# Altium project praline.PrjPcb (part 1 of 3)
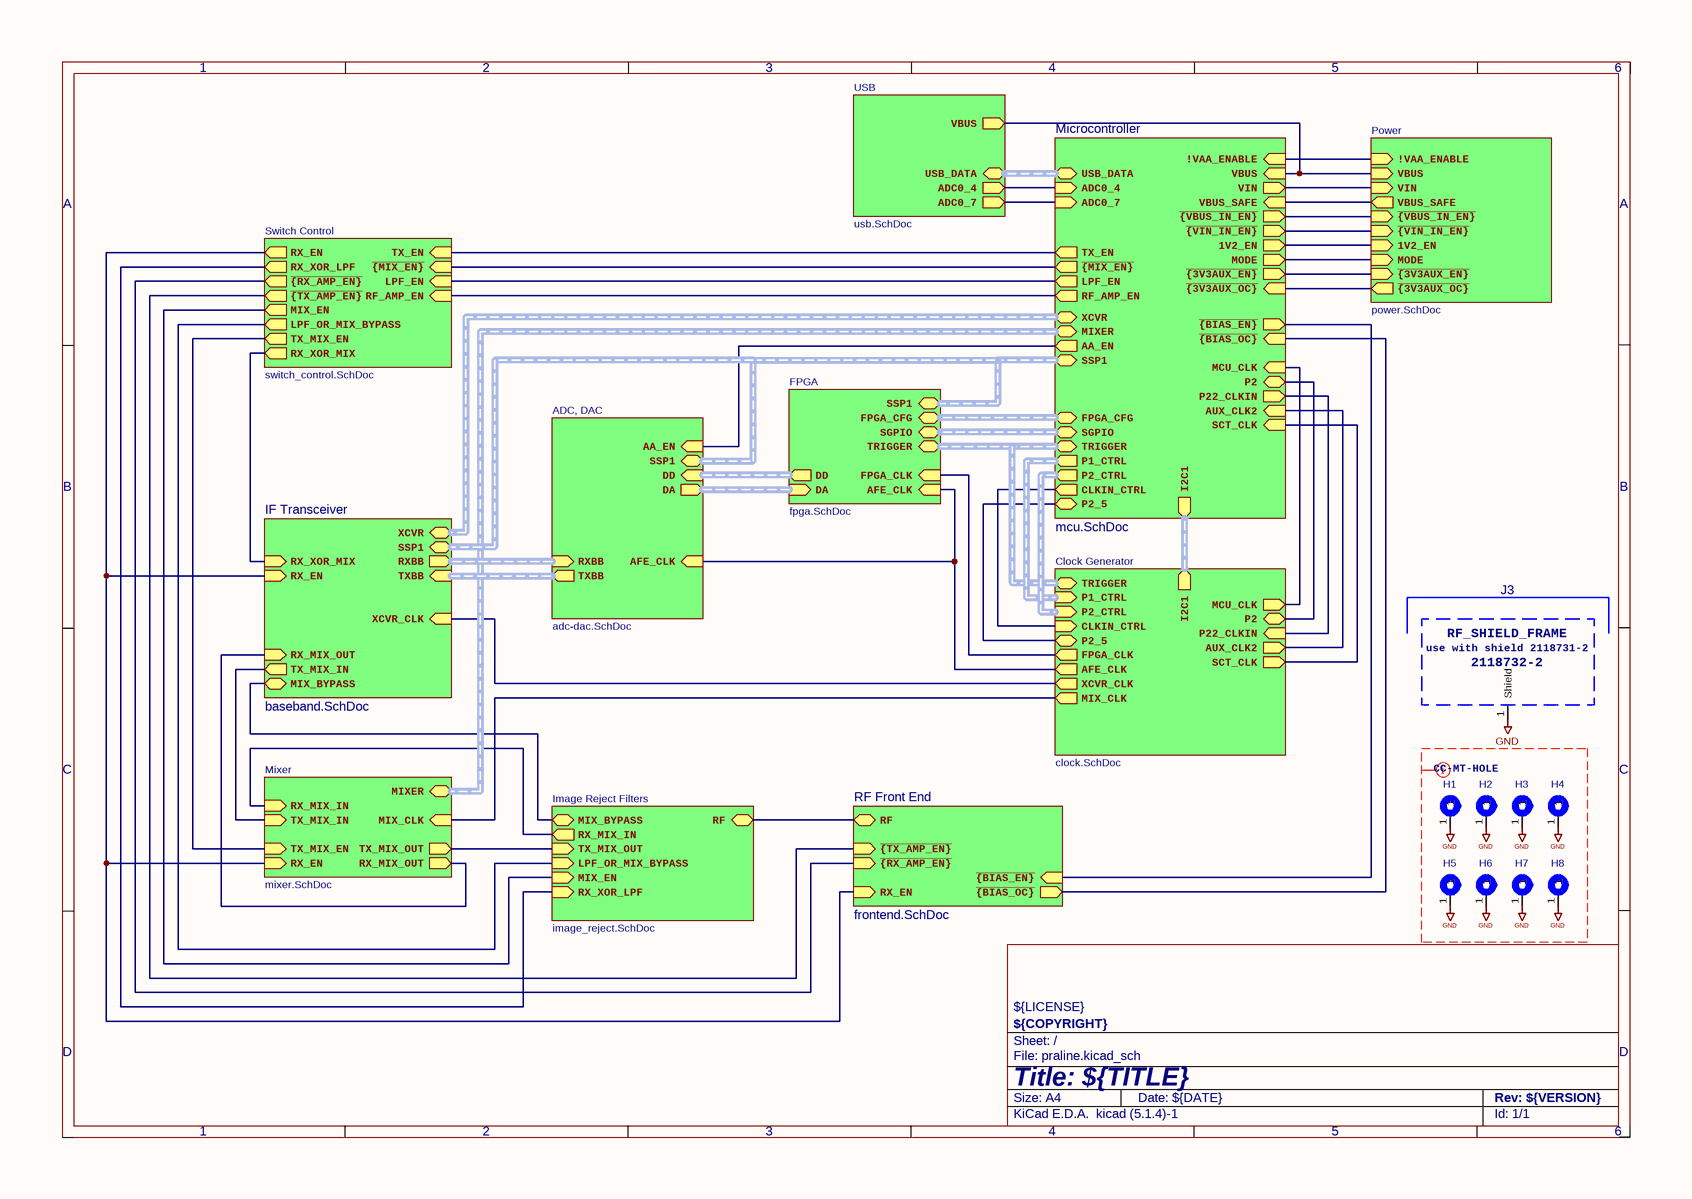
[diagram p0: praline.SchDoc]
12 sheets, 580 parts. Net scope: hierarchical (ports join the sheet entries above them; power ports are global).
Board file: praline.PcbDoc
Sheets:
  praline.SchDoc
    Microcontroller = mcu.SchDoc
    IF Transceiver = baseband.SchDoc
    RF Front End = frontend.SchDoc
    ADC, DAC = adc-dac.SchDoc
    Power = power.SchDoc
    USB = usb.SchDoc
    Mixer = mixer.SchDoc
    Clock Generator = clock.SchDoc
    Switch Control = switch_control.SchDoc
    FPGA = fpga.SchDoc
    Image Reject Filters = image_reject.SchDoc

## Sheet praline.SchDoc
size 297 x 209 mm

### Parts
H1  MountingHole_Pad  [MountingHole_3.2mm_M3_Pad_Via]  (value not drawn)
H2  MountingHole_Pad  [MountingHole_3.2mm_M3_Pad_Via]  (value not drawn)
H3  MountingHole_Pad  [MountingHole_3.2mm_M3_Pad_Via]  (value not drawn)
H4  MountingHole_Pad  [MountingHole_3.2mm_M3_Pad_Via]  (value not drawn)
H5  MountingHole_Pad  [MountingHole_2.2mm_M2_Pad_Via]  (value not drawn)
H6  MountingHole_Pad  [MountingHole_2.2mm_M2_Pad_Via]  (value not drawn)
H7  MountingHole_Pad  [MountingHole_2.2mm_M2_Pad_Via]  (value not drawn)
H8  MountingHole_Pad  [MountingHole_2.2mm_M2_Pad_Via]  (value not drawn)
J3  Part Number: 2118732-2  Note: use with shield 2118731-2  [Laird_Technologies_BMI-S-230-F_50.8x38.1mm]  (hidden comment: RF_SHIELD_FRAME)

### Sub-sheets
ADC, DAC = adc-dac.SchDoc: AFE_CLK (in), RXBB (in, harness RXBB), TXBB (out, harness TXBB), DD (in, harness DD), DA (out, harness DA), AA_EN (in), SSP1 (bidir, harness SSP1)
Clock Generator = clock.SchDoc: MCU_CLK (out), AFE_CLK (out), MIX_CLK (out), XCVR_CLK (out), TRIGGER (bidir, harness TRIGGER), SCT_CLK (out), FPGA_CLK (out), P2_5 (bidir), AUX_CLK2 (out), P1_CTRL (in, harness P1_CTRL), P22_CLKIN (in), P2_CTRL (in, harness P2_CTRL), P2 (bidir), CLKIN_CTRL (in), I2C1 (out, harness I2C1)
FPGA = fpga.SchDoc: DD (out, harness DD), DA (in, harness DA), AFE_CLK (in), FPGA_CLK (in), TRIGGER (bidir, harness TRIGGER), SGPIO (bidir, harness SGPIO), FPGA_CFG (bidir, harness FPGA_CFG), SSP1 (bidir, harness SSP1)
IF Transceiver = baseband.SchDoc: TXBB (in, harness TXBB), RXBB (out, harness RXBB), XCVR_CLK (in), RX_XOR_MIX (in), RX_EN (in), MIX_BYPASS (bidir), TX_MIX_IN (out), RX_MIX_OUT (in), SSP1 (bidir, harness SSP1), XCVR (bidir, harness XCVR)
Image Reject Filters = image_reject.SchDoc: RX_MIX_IN (out), TX_MIX_OUT (in), MIX_BYPASS (bidir), RX_XOR_LPF (in), MIX_EN (in), LPF_OR_MIX_BYPASS (in), RF (bidir)
Microcontroller = mcu.SchDoc: MCU_CLK (in), 1V2_EN (out), VIN (out), VBUS_SAFE (in), ~{{VBUS_IN_EN}} (out), ~{{VIN_IN_EN}} (out), MODE (out), LPF_EN (out), RF_AMP_EN (out), TX_EN (out), ~{{MIX_EN}} (out), ~{{BIAS_EN}} (out), ~{{BIAS_OC}} (in), ~{{3V3AUX_EN}} (out), ~{{3V3AUX_OC}} (in), VBUS (in), USB_DATA (bidir, harness USB_DATA), XCVR (bidir, harness XCVR), SCT_CLK (in), MIXER (bidir, harness MIXER), AA_EN (out), AUX_CLK2 (in), P22_CLKIN (out), P2 (bidir), ADC0_4 (in), ADC0_7 (in), P2_5 (bidir), CLKIN_CTRL (out), P2_CTRL (out, harness P2_CTRL), P1_CTRL (out, harness P1_CTRL), TRIGGER (bidir, harness TRIGGER), SGPIO (bidir, harness SGPIO), FPGA_CFG (bidir, harness FPGA_CFG), SSP1 (bidir, harness SSP1), !VAA_ENABLE (in), I2C1 (out, harness I2C1)
Mixer = mixer.SchDoc: MIX_CLK (in), RX_EN (in), RX_MIX_IN (in), TX_MIX_IN (in), RX_MIX_OUT (out), TX_MIX_OUT (out), MIXER (bidir, harness MIXER), TX_MIX_EN (in)
Power = power.SchDoc: 1V2_EN (in), ~{{VBUS_IN_EN}} (in), VBUS (in), MODE (in), ~{{VIN_IN_EN}} (in), VIN (in), VBUS_SAFE (out), ~{{3V3AUX_EN}} (in), ~{{3V3AUX_OC}} (out), !VAA_ENABLE (in)
RF Front End = frontend.SchDoc: ~{{TX_AMP_EN}} (in), ~{{BIAS_OC}} (out), ~{{RX_AMP_EN}} (in), ~{{BIAS_EN}} (in), RX_EN (in), RF (bidir)
Switch Control = switch_control.SchDoc: TX_EN (in), RX_EN (out), MIX_EN (out), RF_AMP_EN (in), LPF_EN (in), ~{{MIX_EN}} (in), RX_XOR_MIX (out), RX_XOR_LPF (out), ~{{TX_AMP_EN}} (out), ~{{RX_AMP_EN}} (out), LPF_OR_MIX_BYPASS (out), TX_MIX_EN (out)
USB = usb.SchDoc: VBUS (out), USB_DATA (bidir, harness USB_DATA), ADC0_4 (out), ADC0_7 (out)

### Nets
GND: H1.1 H2.1 H3.1 H4.1 H5.1 H6.1 H7.1 H8.1 J3.1(Shield)
1V2_EN: sheet Microcontroller/1V2_EN, sheet Power/1V2_EN
!VAA_ENABLE: sheet Microcontroller/!VAA_ENABLE, sheet Power/!VAA_ENABLE
AA_EN: sheet Microcontroller/AA_EN, sheet ADC, DAC/AA_EN
ADC0_4: sheet Microcontroller/ADC0_4, sheet USB/ADC0_4
ADC0_7: sheet Microcontroller/ADC0_7, sheet USB/ADC0_7
AFE_CLK: sheet ADC, DAC/AFE_CLK, sheet Clock Generator/AFE_CLK, sheet FPGA/AFE_CLK
AUX_CLK2: sheet Microcontroller/AUX_CLK2, sheet Clock Generator/AUX_CLK2
CLKIN_CTRL: sheet Microcontroller/CLKIN_CTRL, sheet Clock Generator/CLKIN_CTRL
FPGA_CLK: sheet Clock Generator/FPGA_CLK, sheet FPGA/FPGA_CLK
LPF_EN: sheet Microcontroller/LPF_EN, sheet Switch Control/LPF_EN
LPF_OR_MIX_BYPASS: sheet Switch Control/LPF_OR_MIX_BYPASS, sheet Image Reject Filters/LPF_OR_MIX_BYPASS
MCU_CLK: sheet Microcontroller/MCU_CLK, sheet Clock Generator/MCU_CLK
MIX_BYPASS: sheet IF Transceiver/MIX_BYPASS, sheet Image Reject Filters/MIX_BYPASS
MIX_CLK: sheet Mixer/MIX_CLK, sheet Clock Generator/MIX_CLK
MIX_EN: sheet Switch Control/MIX_EN, sheet Image Reject Filters/MIX_EN
MODE: sheet Microcontroller/MODE, sheet Power/MODE
P2: sheet Microcontroller/P2, sheet Clock Generator/P2
P2_5: sheet Microcontroller/P2_5, sheet Clock Generator/P2_5
P22_CLKIN: sheet Microcontroller/P22_CLKIN, sheet Clock Generator/P22_CLKIN
RF: sheet RF Front End/RF, sheet Image Reject Filters/RF
RF_AMP_EN: sheet Microcontroller/RF_AMP_EN, sheet Switch Control/RF_AMP_EN
RX_EN: sheet IF Transceiver/RX_EN, sheet RF Front End/RX_EN, sheet Mixer/RX_EN, sheet Switch Control/RX_EN
RX_MIX_IN: sheet Mixer/RX_MIX_IN, sheet Image Reject Filters/RX_MIX_IN
RX_MIX_OUT: sheet IF Transceiver/RX_MIX_OUT, sheet Mixer/RX_MIX_OUT
RX_XOR_LPF: sheet Switch Control/RX_XOR_LPF, sheet Image Reject Filters/RX_XOR_LPF
RX_XOR_MIX: sheet IF Transceiver/RX_XOR_MIX, sheet Switch Control/RX_XOR_MIX
SCT_CLK: sheet Microcontroller/SCT_CLK, sheet Clock Generator/SCT_CLK
TX_EN: sheet Microcontroller/TX_EN, sheet Switch Control/TX_EN
TX_MIX_EN: sheet Mixer/TX_MIX_EN, sheet Switch Control/TX_MIX_EN
TX_MIX_IN: sheet IF Transceiver/TX_MIX_IN, sheet Mixer/TX_MIX_IN
TX_MIX_OUT: sheet Mixer/TX_MIX_OUT, sheet Image Reject Filters/TX_MIX_OUT
VBUS: sheet Microcontroller/VBUS, sheet Power/VBUS, sheet USB/VBUS
VBUS_SAFE: sheet Microcontroller/VBUS_SAFE, sheet Power/VBUS_SAFE
VIN: sheet Microcontroller/VIN, sheet Power/VIN
XCVR_CLK: sheet IF Transceiver/XCVR_CLK, sheet Clock Generator/XCVR_CLK
~{{3V3AUX_EN}}: sheet Microcontroller/~{{3V3AUX_EN}}, sheet Power/~{{3V3AUX_EN}}
~{{3V3AUX_OC}}: sheet Microcontroller/~{{3V3AUX_OC}}, sheet Power/~{{3V3AUX_OC}}
~{{BIAS_EN}}: sheet Microcontroller/~{{BIAS_EN}}, sheet RF Front End/~{{BIAS_EN}}
~{{BIAS_OC}}: sheet Microcontroller/~{{BIAS_OC}}, sheet RF Front End/~{{BIAS_OC}}
~{{MIX_EN}}: sheet Microcontroller/~{{MIX_EN}}, sheet Switch Control/~{{MIX_EN}}
~{{RX_AMP_EN}}: sheet RF Front End/~{{RX_AMP_EN}}, sheet Switch Control/~{{RX_AMP_EN}}
~{{TX_AMP_EN}}: sheet RF Front End/~{{TX_AMP_EN}}, sheet Switch Control/~{{TX_AMP_EN}}
~{{VBUS_IN_EN}}: sheet Microcontroller/~{{VBUS_IN_EN}}, sheet Power/~{{VBUS_IN_EN}}
~{{VIN_IN_EN}}: sheet Microcontroller/~{{VIN_IN_EN}}, sheet Power/~{{VIN_IN_EN}}

### Buses and harness runs
harness sheet ADC, DAC/DA = sheet FPGA/DA
harness sheet ADC, DAC/DD = sheet FPGA/DD
harness sheet ADC, DAC/RXBB = sheet IF Transceiver/RXBB
harness sheet ADC, DAC/SSP1 = sheet FPGA/SSP1 = sheet IF Transceiver/SSP1 = sheet Microcontroller/SSP1
harness sheet ADC, DAC/TXBB = sheet IF Transceiver/TXBB
harness sheet Clock Generator/I2C1 = sheet Microcontroller/I2C1
harness sheet Clock Generator/P1_CTRL = sheet Microcontroller/P1_CTRL
harness sheet Clock Generator/P2_CTRL = sheet Microcontroller/P2_CTRL
harness sheet Clock Generator/TRIGGER = sheet FPGA/TRIGGER = sheet Microcontroller/TRIGGER
harness sheet FPGA/FPGA_CFG = sheet Microcontroller/FPGA_CFG
harness sheet FPGA/SGPIO = sheet Microcontroller/SGPIO
harness sheet IF Transceiver/XCVR = sheet Microcontroller/XCVR
harness sheet Microcontroller/MIXER = sheet Mixer/MIXER
harness sheet Microcontroller/USB_DATA = sheet USB/USB_DATA

### Layout directives
CompClassName: CC-MT-HOLE: GND

### Notes on the sheet
- 1
- 2
- 3
- 4
- 5
- 6
- A
- B
- C
- ${LICENSE}
- D
- Title: ${TITLE}
- File: praline.kicad_sch
- Sheet: /
- ${COPYRIGHT}
- KiCad E.D.A.  kicad (5.1.4)-1
- Size: A4
- Date: ${DATE}
- Rev: ${VERSION}
- Id: 1/1

### Library data of the parts
J3 = RFShield_TwoPieces: Manufacturer: TE Connectivity; Value: RF_SHIELD_FRAME; Footprint: praline:Laird_Technologies_BMI-S-230-F_50.8x38.1mm
H1-H8 = MountingHole_Pad: Value: MountingHole_Pad
  H1-H4: Footprint: praline:MountingHole_3.2mm_M3_Pad_Via
  H5-H8: Footprint: MountingHole:MountingHole_2.2mm_M2_Pad_Via

## Sheet mcu.SchDoc
size 431 x 279 mm
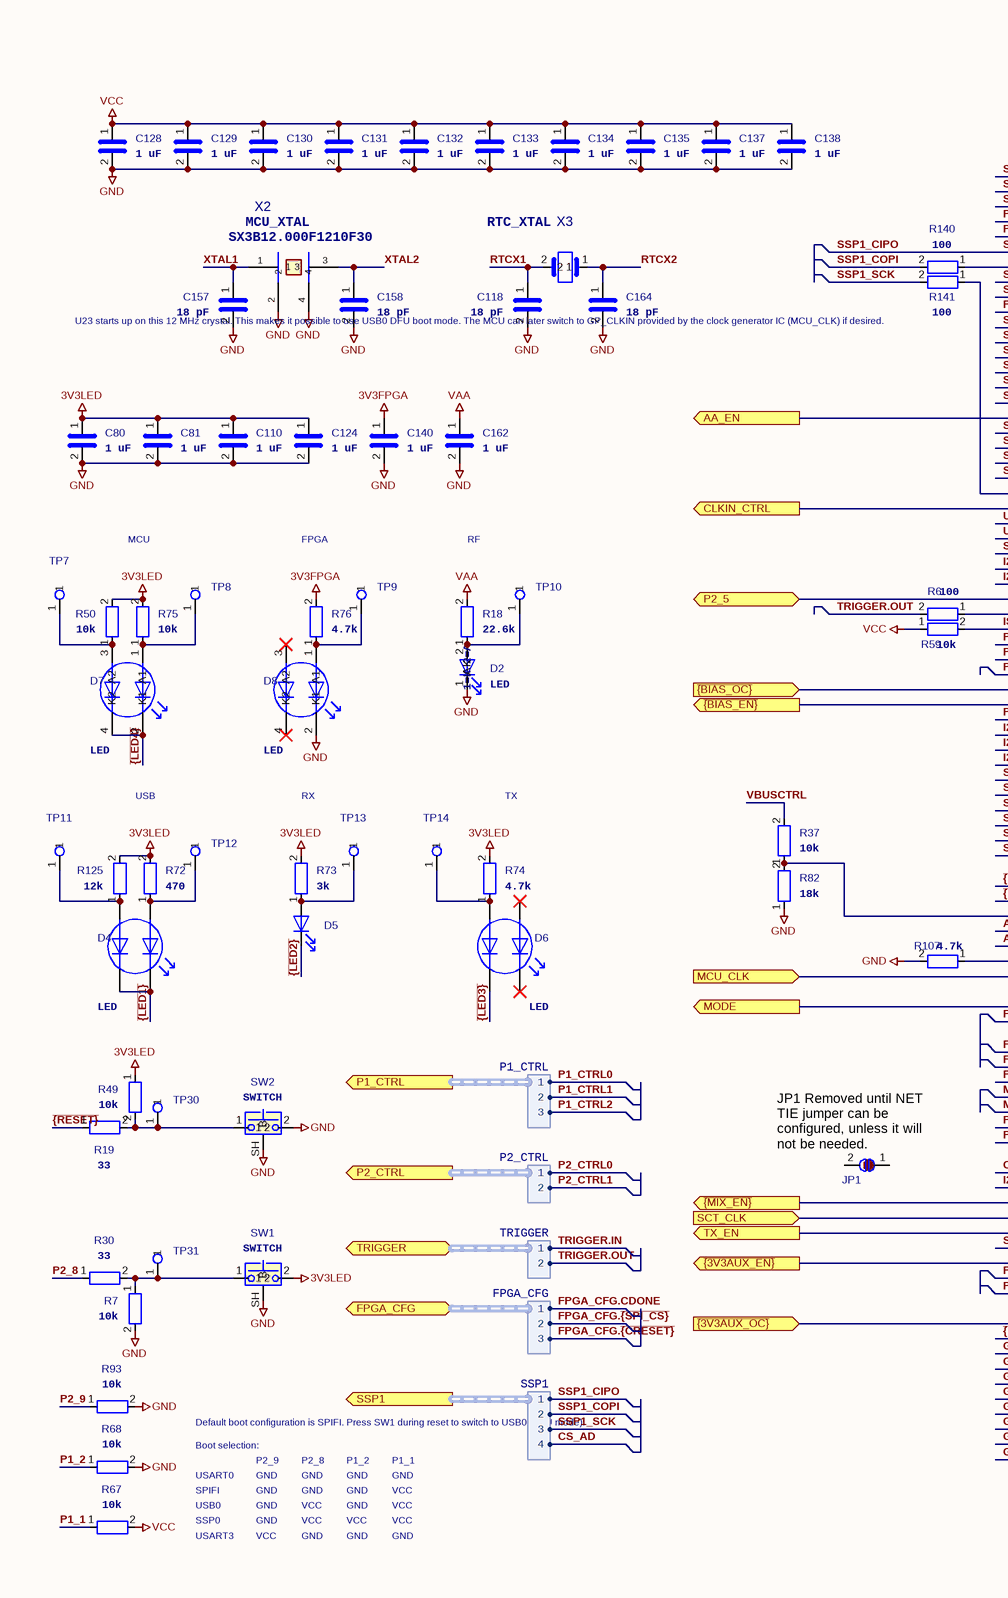
[diagram p1: mcu.SchDoc, left]
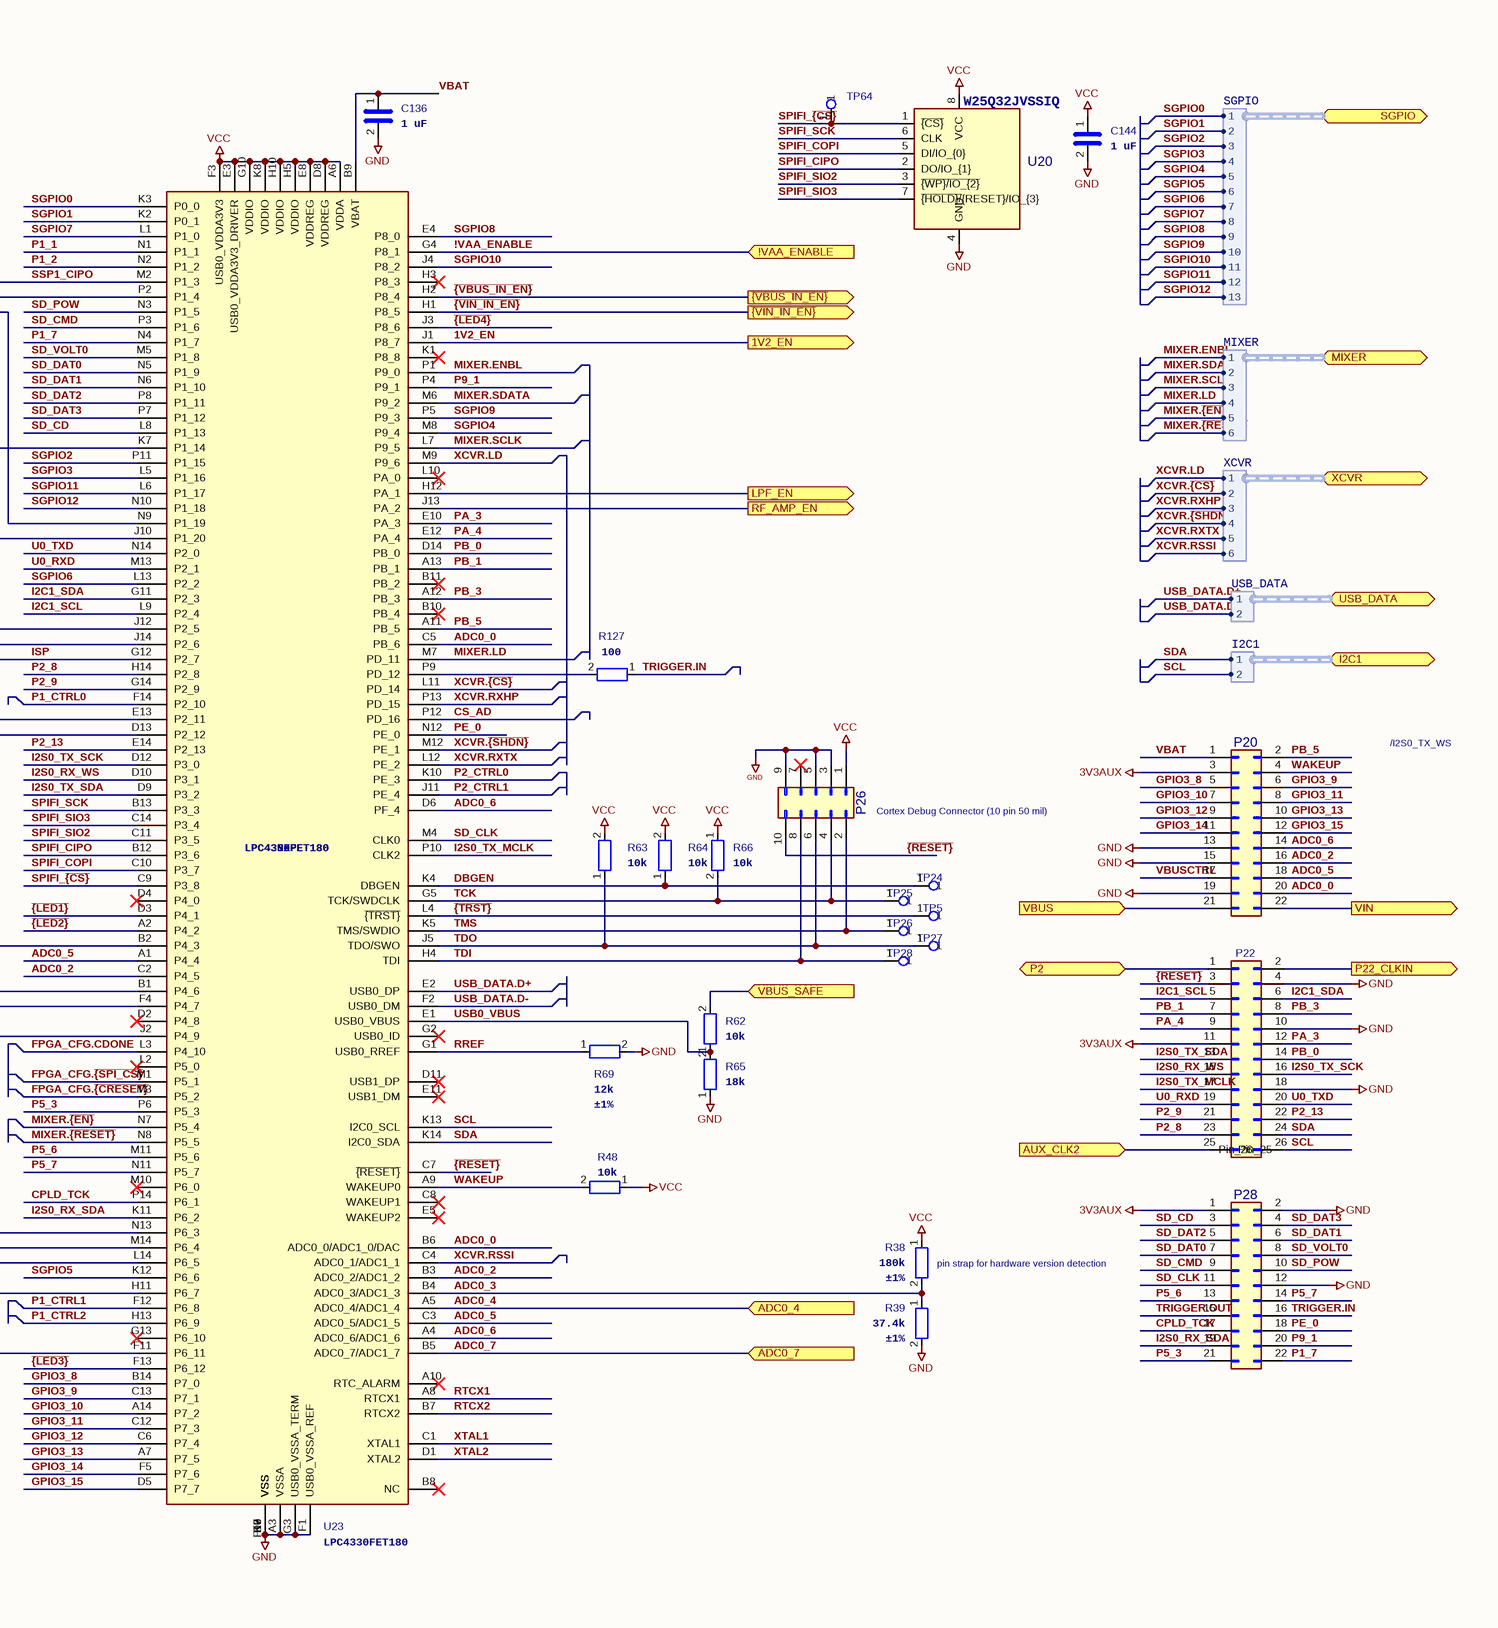
[diagram p2: mcu.SchDoc, right]

### Parts
C80  1 uF  [C_0402_1005Metric]
C81  1 uF  [C_0402_1005Metric]
C110  1 uF  [C_0402_1005Metric]
C118  18 pF  [C_0402_1005Metric]
C124  1 uF  [C_0402_1005Metric]
C128  1 uF  [C_0402_1005Metric]
C129  1 uF  [C_0402_1005Metric]
C130  1 uF  [C_0402_1005Metric]
C131  1 uF  [C_0402_1005Metric]
C132  1 uF  [C_0402_1005Metric]
C133  1 uF  [C_0402_1005Metric]
C134  1 uF  [C_0402_1005Metric]
C135  1 uF  [C_0402_1005Metric]
C136  1 uF  [C_0402_1005Metric]
C137  1 uF  [C_0402_1005Metric]
C138  1 uF  [C_0402_1005Metric]
C140  1 uF  [C_0402_1005Metric]
C144  1 uF  [C_0402_1005Metric]
C157  18 pF  [C_0402_1005Metric]
C158  18 pF  [C_0402_1005Metric]
C162  1 uF  [C_0402_1005Metric]
C164  18 pF  [C_0402_1005Metric]
D2  Sim.Pins: 1=K 2=A  [LED_Single_Xinglight_XL-3210_Horizontal]  (hidden comment: LED)
D4  LED  [LED_Dual_Xinglight_XL-3210_Horizontal]
D5  LED  [LED_Single_Xinglight_XL-3210_Horizontal]  (value not drawn)
D6  LED  [LED_Dual_Xinglight_XL-3210_Horizontal]
D7  LED  [LED_Dual_Xinglight_XL-3210_Horizontal]
D8  LED  [LED_Dual_Xinglight_XL-3210_Horizontal]
JP1  SolderJumper_2_Bridged  [SolderJumper-2_P1.3mm_Bridged_RoundedPad1.0x1.5mm]  (value not drawn)  (graphical)
P20  HEADER_2x11  [PinSocket_2x11_P2.54mm_Vertical_Flipped]  (value not drawn)
P22  HEADER_2x13  [PinSocket_2x13_P2.54mm_Vertical_Flipped]  (value not drawn)
P26  LPC_JTAG  [PinHeader_2x05_P1.27mm_Vertical]  (value not drawn)
P28  HEADER_2x11  [PinSocket_2x11_P2.54mm_Vertical_Flipped]  (value not drawn)
R6  100  [R_0201_0603Metric]
R7  10k  [R_0402_1005Metric]
R18  22.6k  [R_0201_0603Metric]
R19  33  [R_0201_0603Metric]
R30  33  [R_0201_0603Metric]
R37  10k  [R_0402_1005Metric]
R38  Tolerance: ±1%  [R_0402_1005Metric]  (hidden comment: 180k)
R39  Tolerance: ±1%  [R_0402_1005Metric]  (hidden comment: 37.4k)
R48  10k  [R_0402_1005Metric]
R49  10k  [R_0402_1005Metric]
R50  10k  [R_0402_1005Metric]
R59  10k  [R_0402_1005Metric]
R62  10k  [R_0402_1005Metric]
R63  10k  [R_0402_1005Metric]
R64  10k  [R_0402_1005Metric]
R65  18k  [R_0402_1005Metric]
R66  10k  [R_0402_1005Metric]
R67  10k  [R_0402_1005Metric]
R68  10k  [R_0402_1005Metric]
R69  Tolerance: ±1%  [R_0201_0603Metric]  (hidden comment: 12k)
R72  470  [R_0201_0603Metric]
R73  3k  [R_0402_1005Metric]
R74  4.7k  [R_0201_0603Metric]
R75  10k  [R_0402_1005Metric]
R76  4.7k  [R_0201_0603Metric]
R82  18k  [R_0402_1005Metric]
R93  10k  [R_0402_1005Metric]
R107  4.7k  [R_0201_0603Metric]
R125  12k  [R_0201_0603Metric]
R127  100  [R_0201_0603Metric]
R140  100  [R_0201_0603Metric]
R141  100  [R_0201_0603Metric]
SW1  SWITCH  [SW_Tactile_SPST_Angled_PTS645Vx58-2LFS]
SW2  SWITCH  [SW_Tactile_SPST_Angled_PTS645Vx58-2LFS]
TP5  TestPoint  [TestPoint_Pad_D1.0mm]  (value not drawn)
TP7  TestPoint  [TestPoint_Pad_D1.0mm]  (value not drawn)
TP8  TestPoint  [TestPoint_Pad_D1.0mm]  (value not drawn)
TP9  TestPoint  [TestPoint_Pad_D1.0mm]  (value not drawn)
TP10  TestPoint  [TestPoint_Pad_D1.0mm]  (value not drawn)
TP11  TestPoint  [TestPoint_Pad_D1.0mm]  (value not drawn)
TP12  TestPoint  [TestPoint_Pad_D1.0mm]  (value not drawn)
TP13  TestPoint  [TestPoint_Pad_D1.0mm]  (value not drawn)
TP14  TestPoint  [TestPoint_Pad_D1.0mm]  (value not drawn)
TP24  TestPoint  [TestPoint_Pad_D1.0mm]  (value not drawn)
TP25  TestPoint  [TestPoint_Pad_D1.0mm]  (value not drawn)
TP26  TestPoint  [TestPoint_Pad_D1.0mm]  (value not drawn)
TP27  TestPoint  [TestPoint_Pad_D1.0mm]  (value not drawn)
TP28  TestPoint  [TestPoint_Pad_D1.0mm]  (value not drawn)
TP30  TestPoint  [TestPoint_Pad_D1.0mm]  (value not drawn)
TP31  TestPoint  [TestPoint_Pad_D1.0mm]  (value not drawn)
TP64  TestPoint  [TestPoint_Pad_D1.0mm]  (value not drawn)
U20  Part Number: W25Q32JVSSIQ  [SOIC-8_5.3x5.3mm_P1.27mm]  (hidden comment: W25Q32)
U23  Manufacturer: NXP  Substitution: LPC4350FET180  [TFBGA-180_12x12mm_Layout14x14_P0.8mm]  (hidden comment: LPC4330FET180)
X2  Part Number: SX3B12.000F1210F30  [Crystal_SMD_3225-4Pin_3.2x2.5mm]  (hidden comment: MCU_XTAL)
X3  RTC_XTAL  [Crystal_SMD_3215-2Pin_3.2x1.5mm]

### Ports
1V2_EN (out), !VAA_ENABLE (in), AA_EN (out), ADC0_4 (in), ADC0_7 (in), AUX_CLK2 (in), CLKIN_CTRL (out), FPGA_CFG (bidir, harness FPGA_CFG), I2C1 (bidir, harness I2C1), LPF_EN (out), MCU_CLK (in), MIXER (bidir, harness MIXER), MODE (out), P1_CTRL (out, harness P1_CTRL), P2 (bidir), P2_5 (bidir), P2_CTRL (out, harness P2_CTRL), P22_CLKIN (out), RF_AMP_EN (out), SCT_CLK (in), SGPIO (bidir, harness SGPIO), SSP1 (out, harness SSP1), TRIGGER (bidir, harness TRIGGER), TX_EN (out), USB_DATA (bidir, harness USB_DATA), VBUS (in), VBUS_SAFE (in), VIN (out), XCVR (bidir, harness XCVR), ~{{3V3AUX_EN}} (out), ~{{3V3AUX_OC}} (in), ~{{BIAS_EN}} (out), ~{{BIAS_OC}} (in), ~{{MIX_EN}} (out), ~{{VBUS_IN_EN}} (out), ~{{VIN_IN_EN}} (out)

### Harnesses
XCVR: 1, 5, 4, 3, 2, 6
MIXER: 1, 6, 5, 4, 3, 2
USB_DATA: 1, 2
SGPIO: 1, 5, 4, 3, 2, 13, 7, 8, 11, 9, 12, 10, 6
P1_CTRL: 1, 2, 3
P2_CTRL: 1, 2
TRIGGER: 1, 2
FPGA_CFG: 1, 2, 3
SSP1: 1, 2, 3, 4
I2C1: 1, 2

### Nets
3V3AUX: P20.3(Pin_3) P22.11(Pin_11) P28.1(Pin_1)
3V3FPGA: C140.1 R76.2
3V3LED: C80.1 C81.1 C110.1 C124.1 R49.1 R50.2 R72.2 R73.2 R74.2 R75.2 R125.2 SW1.2
GND: C80.2 C81.2 C110.2 C118.2 C124.2 C128.2 C129.2 C130.2 C131.2 C132.2 C133.2 C134.2 C135.2 C136.2 C137.2 C138.2 C140.2 C144.2 C157.2 C158.2 C162.2 C164.2 D2.1(K) D8.2(K1) P20.13(Pin_13) P20.15(Pin_15) P20.19(Pin_19) P22.4(Pin_4) P22.10(Pin_10) P22.18(Pin_18) P26.3(Pin_3) P26.5(Pin_5) P26.9(Pin_9) P28.2(Pin_2) P28.12(Pin_12) R7.2 R39.2 R65.1 R68.2 R69.2 R82.1 R93.2 R107.2 SW1.SH(B) SW2.2 SW2.SH(B) U20.4(GND) U23.A3(VSSA) U23.D7(VSS) U23.E6(VSS) U23.E7(VSS) U23.E9(VSS) U23.F1(USB0_VSSA_REF) U23.F10(VSS) U23.G3(USB0_VSSA_TERM) U23.K6(VSS) U23.K9(VSS) X2.2 X2.4
VAA: C162.1 R18.2
VCC: C128.1 C129.1 C130.1 C131.1 C132.1 C133.1 C134.1 C135.1 C137.1 C138.1 C144.1 P26.1(Pin_1) R38.1 R48.1 R59.1 R63.2 R64.2 R66.1 R67.2 U20.8(VCC) U23.A6(VDDA) U23.D8(VDDREG) U23.E3(USB0_VDDA3V3_DRIVER) U23.E8(VDDREG) U23.F3(USB0_VDDA3V3) U23.G10(VDDIO) U23.H5(VDDIO) U23.H10(VDDIO) U23.K8(VDDIO)
1V2_EN: U23.J1(P8_7) ; port 1V2_EN
!VAA_ENABLE: U23.G4(P8_1) ; port !VAA_ENABLE
AA_EN: U23.K7(P1_14) ; port AA_EN
ADC0_0: P20.20(Pin_20) U23.B6(ADC0_0/ADC1_0/DAC) U23.C5(PB_6)
ADC0_2: P20.16(Pin_16) U23.B3(ADC0_2/ADC1_2) U23.C2(P4_5)
ADC0_3: R38.2 R39.1 U23.B4(ADC0_3/ADC1_3)
ADC0_4: U23.A5(ADC0_4/ADC1_4) ; port ADC0_4
ADC0_5: P20.18(Pin_18) U23.A1(P4_4) U23.C3(ADC0_5/ADC1_5)
ADC0_6: P20.14(Pin_14) U23.A4(ADC0_6/ADC1_6) U23.D6(PF_4)
ADC0_7: U23.B5(ADC0_7/ADC1_7) ; port ADC0_7
AUX_CLK2: P22.25(Pin_25) ; port AUX_CLK2
CLKIN_CTRL: U23.J10(P1_20) ; port CLKIN_CTRL
CPLD_TCK: P28.17(Pin_17) U23.P14(P6_1)
CS_AD: U23.P12(PD_16) ; port SSP1.4
DBGEN: R64.1 TP24.1 U23.K4(DBGEN)
FPGA_CFG.CDONE: U23.L3(P4_10) ; port FPGA_CFG.1
FPGA_CFG.~{{CRESET}}: U23.M3(P5_2) ; port FPGA_CFG.3
FPGA_CFG.~{{SPI_CS}}: U23.M1(P5_1) ; port FPGA_CFG.2
GPIO3_8: P20.5(Pin_5) U23.B14(P7_0)
GPIO3_9: P20.6(Pin_6) U23.C13(P7_1)
GPIO3_10: P20.7(Pin_7) U23.A14(P7_2)
GPIO3_11: P20.8(Pin_8) U23.C12(P7_3)
GPIO3_12: P20.9(Pin_9) U23.C6(P7_4)
GPIO3_13: P20.10(Pin_10) U23.A7(P7_5)
GPIO3_14: P20.11(Pin_11) U23.F5(P7_6)
GPIO3_15: P20.12(Pin_12) U23.D5(P7_7)
I2C1_SCL: P22.5(Pin_5) U23.L9(P2_4)
I2C1_SDA: P22.6(Pin_6) U23.G11(P2_3)
I2S0_RX_SDA: P28.19(Pin_19) U23.K11(P6_2)
I2S0_RX_WS: P22.15(Pin_15) U23.D10(P3_1)
I2S0_TX_MCLK: P22.17(Pin_17) U23.P10(CLK2)
I2S0_TX_SCK: P22.16(Pin_16) U23.D12(P3_0)
I2S0_TX_SDA: P22.13(Pin_13) U23.D9(P3_2)
ISP: R59.2 U23.G12(P2_7)
LPF_EN: U23.H12(PA_1) ; port LPF_EN
MCU_CLK: U23.F4(P4_7) ; port MCU_CLK
MIXER.ENBL: U23.P1(P9_0) ; port MIXER.1
MIXER.LD: U23.M7(PD_11) ; port MIXER.4
MIXER.SCLK: U23.L7(P9_5) ; port MIXER.3
MIXER.SDATA: U23.M6(P9_2) ; port MIXER.2
MIXER.~{{EN}}: U23.N7(P5_4) ; port MIXER.5
MIXER.~{{RESET}}: U23.N8(P5_5) ; port MIXER.6
MODE: U23.J2(P4_9) ; port MODE
P1_1: R67.1 U23.N1(P1_1)
P1_2: R68.1 U23.N2(P1_2)
P1_7: P28.22(Pin_22) U23.N4(P1_7)
P1_CTRL0: U23.F14(P2_10) ; port P1_CTRL.1
P1_CTRL1: U23.F12(P6_8) ; port P1_CTRL.2
P1_CTRL2: U23.H13(P6_9) ; port P1_CTRL.3
P2: P22.1(Pin_1) ; port P2
P2_5: U23.J12(P2_5) ; port P2_5
P2_8: P22.23(Pin_23) R30.1 U23.H14(P2_8)
P2_9: P22.21(Pin_21) R93.1 U23.G14(P2_9)
P2_13: P22.22(Pin_22) U23.E14(P2_13)
P2_CTRL0: U23.K10(PE_3) ; port P2_CTRL.1
P2_CTRL1: U23.J11(PE_4) ; port P2_CTRL.2
P5_3: P28.21(Pin_21) U23.P6(P5_3)
P5_6: P28.13(Pin_13) U23.M11(P5_6)
P5_7: P28.14(Pin_14) U23.N11(P5_7)
P9_1: P28.20(Pin_20) U23.P4(P9_1)
P22_CLKIN: P22.2(Pin_2) ; port P22_CLKIN
PA_3: P22.12(Pin_12) U23.E10(PA_3)
PA_4: P22.9(Pin_9) U23.E12(PA_4)
PB_0: P22.14(Pin_14) U23.D14(PB_0)
PB_1: P22.7(Pin_7) U23.A13(PB_1)
PB_3: P22.8(Pin_8) U23.A12(PB_3)
PB_5: P20.2(Pin_2) U23.A11(PB_5)
PE_0: P28.18(Pin_18) U23.N12(PE_0)
RF_AMP_EN: U23.J13(PA_2) ; port RF_AMP_EN
RREF: R69.1 U23.G1(USB0_RREF)
RTCX1: C118.1 U23.A8(RTCX1) X3.2
RTCX2: C164.1 U23.B7(RTCX2) X3.1
SCL: P22.26(Pin_26) U23.K13(I2C0_SCL) ; port I2C1.2
SCT_CLK: U23.M14(P6_4) ; port SCT_CLK
SD_CD: P28.3(Pin_3) U23.L8(P1_13)
SD_CLK: P28.11(Pin_11) U23.M4(CLK0)
SD_CMD: P28.9(Pin_9) U23.P3(P1_6)
SD_DAT0: P28.7(Pin_7) U23.N5(P1_9)
SD_DAT1: P28.6(Pin_6) U23.N6(P1_10)
SD_DAT2: P28.5(Pin_5) U23.P8(P1_11)
SD_DAT3: P28.4(Pin_4) U23.P7(P1_12)
SD_POW: P28.10(Pin_10) U23.N3(P1_5)
SD_VOLT0: P28.8(Pin_8) U23.M5(P1_8)
SDA: P22.24(Pin_24) U23.K14(I2C0_SDA) ; port I2C1.1
SGPIO0: U23.K3(P0_0) ; port SGPIO.1
SGPIO1: U23.K2(P0_1) ; port SGPIO.2
SGPIO2: U23.P11(P1_15) ; port SGPIO.3
SGPIO3: U23.L5(P1_16) ; port SGPIO.4
SGPIO4: U23.M8(P9_4) ; port SGPIO.5
SGPIO5: U23.K12(P6_6) ; port SGPIO.6
SGPIO6: U23.L13(P2_2) ; port SGPIO.7
SGPIO7: U23.L1(P1_0) ; port SGPIO.8
SGPIO8: U23.E4(P8_0) ; port SGPIO.9
SGPIO9: U23.P5(P9_3) ; port SGPIO.10
SGPIO10: U23.J4(P8_2) ; port SGPIO.11
SGPIO11: U23.L6(P1_17) ; port SGPIO.12
SGPIO12: U23.N10(P1_18) ; port SGPIO.13
SPIFI_CIPO: U20.2(DO/IO_{1}) U23.B12(P3_6)
SPIFI_COPI: U20.5(DI/IO_{0}) U23.C10(P3_7)
SPIFI_SCK: U20.6(CLK) U23.B13(P3_3)
SPIFI_SIO2: U20.3(~{{WP}/IO_{2}}) U23.C11(P3_5)
SPIFI_SIO3: U20.7(~{{HOLD}/}{RESET}/IO_{3}) U23.C14(P3_4)
SPIFI_~{{CS}}: TP64.1 U20.1(~{{CS}}) U23.C9(P3_8)
SSP1_CIPO: U23.M2(P1_3) ; port SSP1.1
SSP1_COPI: R140.2 ; port SSP1.2
SSP1_SCK: R141.2 ; port SSP1.3
TCK: P26.4(Pin_4) R66.2 TP25.1 U23.G5(TCK/SWDCLK)
TDI: P26.8(Pin_8) TP28.1 U23.H4(TDI)
TDO: P26.6(Pin_6) R63.1 TP27.1 U23.J5(TDO/SWO)
TMS: P26.2(Pin_2) TP26.1 U23.K5(TMS/SWDIO)
TRIGGER.IN: P28.16(Pin_16) R127.1 ; port TRIGGER.1
TRIGGER.OUT: P28.15(Pin_15) R6.2 ; port TRIGGER.2
TX_EN: U23.L14(P6_5) ; port TX_EN
U0_RXD: P22.19(Pin_19) U23.M13(P2_1)
U0_TXD: P22.20(Pin_20) U23.N14(P2_0)
USB0_VBUS: R62.1 R65.2 U23.E1(USB0_VBUS)
USB_DATA.D+: U23.E2(USB0_DP) ; port USB_DATA.1
USB_DATA.D-: U23.F2(USB0_DM) ; port USB_DATA.2
VBAT: C136.1 P20.1(Pin_1) U23.B9(VBAT)
VBUS: P20.21(Pin_21) ; port VBUS
VBUS_SAFE: R62.2 ; port VBUS_SAFE
VBUSCTRL: P20.17(Pin_17) R37.2
VIN: P20.22(Pin_22) ; port VIN
WAKEUP: P20.4(Pin_4) R48.2 U23.A9(WAKEUP0)
XCVR.LD: U23.M9(P9_6) ; port XCVR.1
XCVR.RSSI: U23.C4(ADC0_1/ADC1_1) ; port XCVR.6
XCVR.RXHP: U23.P13(PD_15) ; port XCVR.3
XCVR.RXTX: U23.L12(PE_2) ; port XCVR.5
XCVR.~{{CS}}: U23.L11(PD_14) ; port XCVR.2
XCVR.~{{SHDN}}: U23.M12(PE_1) ; port XCVR.4
XTAL1: C157.1 U23.C1(XTAL1) X2.1
XTAL2: C158.1 U23.D1(XTAL2) X2.3
~{{3V3AUX_EN}}: U23.H11(P6_7) ; port ~{{3V3AUX_EN}}
~{{3V3AUX_OC}}: U23.F11(P6_11) ; port ~{{3V3AUX_OC}}
~{{BIAS_EN}}: U23.D13(P2_12) ; port ~{{BIAS_EN}}
~{{BIAS_OC}}: U23.E13(P2_11) ; port ~{{BIAS_OC}}
~{{LED1}}: D4.2(K1) D4.4(K2) U23.D3(P4_1)
~{{LED2}}: D5.1(K) U23.A2(P4_2)
~{{LED3}}: D6.4(K2) U23.F13(P6_12)
~{{LED4}}: D7.2(K1) D7.4(K2) U23.J3(P8_6)
~{{MIX_EN}}: U23.N13(P6_3) ; port ~{{MIX_EN}}
~{{RESET}}: P22.3(Pin_3) P26.10(Pin_10) R19.1 U23.C7(~{{RESET}})
~{{TRST}}: TP5.1 U23.L4(~{{TRST}})
~{{VBUS_IN_EN}}: U23.H2(P8_4) ; port ~{{VBUS_IN_EN}}
~{{VIN_IN_EN}}: U23.H1(P8_5) ; port ~{{VIN_IN_EN}}
NetD2_2: D2.2(A) R18.1 TP10.1
NetD4_1: D4.1(A1) R72.1 TP12.1
NetD4_3: D4.3(A2) R125.1 TP11.1
NetD5_2: D5.2(A) R73.1 TP13.1
NetD6_3: D6.3(A2) R74.1 TP14.1
NetD7_1: D7.1(A1) R75.1 TP8.1
NetD7_3: D7.3(A2) R50.1 TP7.1
NetD8_1: D8.1(A1) R76.1 TP9.1
NetR6_1: R6.1 U23.J14(P2_6)
NetR7_1: R7.1 R30.2 SW1.1 TP31.1
NetR19_2: R19.2 R49.2 SW2.1 TP30.1
NetR37_1: R37.1 R82.2 U23.B2(P4_3)
NetR107_1: R107.1 U23.B1(P4_6)
NetR127_2: R127.2 U23.P9(PD_12)
NetR140_1: R140.1 U23.P2(P1_4)
NetR141_1: R141.1 U23.N9(P1_19)

Not connected (* = marked no-connect by the designer): D6 1(A1)* 2(K1)*; D8 3(A2)* 4(K2)*; JP1 1(A) 2(B); P26 7(Pin_7)*; U23 A10(RTC_ALARM)* B8(NC)* B10(PB_4)* B11(PB_2)* C8(WAKEUP1)* D2(P4_8)* D4(P4_0)* D11(USB1_DP)* E5(WAKEUP2)* E11(USB1_DM)* G2(USB0_ID)* G13(P6_10)* H3(P8_3)* K1(P8_8)* L2(P5_0)* L10(PA_0)* M10(P6_0)*

### Notes on the sheet
- U23 starts up on this 12 MHz
  crystal. This makes it possible
  to use USB0 DFU boot mode.
  The MCU can later switch
  to GP_CLKIN provided by the
  clock generator IC (MCU_CLK)
  if desired.
- MCU
- FPGA
- RF
- /I2S0_TX_WS
- USB
- RX
- TX
- (near P26) Cortex Debug
  Connector
  (10 pin 50 mil)
- (near JP1) JP1 Removed until NET TIE jumper can be configured, unless it will not be needed.
- (near R38) pin strap for hardware
  version detection
- Default boot configuration is SPIFI.
  Press SW1 during reset to switch to
  USB0 (DFU mode).
- USB0
- Boot selection:
- USART0
- SPIFI
- GND
- P2_9
- P2_8
- VCC
- P1_2
- P1_1
- SSP0
- USART3
- 1
- 2
- 3
- 4
- 5
- 6
- 7
- 8
- A
- B
- C
- D
- E
- ${LICENSE}
- Title: ${TITLE}
- File: mcu.kicad_sch
- Sheet: /
- ${COPYRIGHT}
- KiCad E.D.A.  kicad (5.1.4)-1
- Size: User
- Date: ${DATE}
- Rev: ${VERSION}
- Id: 1/1

### Library data of the parts
C80 C81 C110 C124 C128-C138 C140 C144 C162 = C: Manufacturer: Samsung; Part Number: CL05A105KA5NQNC; Substitution: Murata GRM155R61E105KA12D; Value: 1 uF; Footprint: Capacitor_SMD:C_0402_1005Metric
C118 C157 C158 C164 = C: Manufacturer: Samsung; Part Number: CL05C180JB5NNNC; Substitution: Murata GRM1555C1H180JA01D; Value: 18 pF; Footprint: Capacitor_SMD:C_0402_1005Metric
D2 = LED: Manufacturer: Xinglight; Part Number: XL-3210UGC; Value: LED; Footprint: praline:LED_Single_Xinglight_XL-3210_Horizontal
D4 = LED_Dual_AKAK: Manufacturer: Xinglight; Part Number: XL-3210SURSYGC; Value: LED; Footprint: praline:LED_Dual_Xinglight_XL-3210_Horizontal
D5 = LED: Manufacturer: Xinglight; Part Number: XL-3210UOC; Sim.Pins: 1=K 2=A; Value: LED; Footprint: praline:LED_Single_Xinglight_XL-3210_Horizontal
D6-D8 = LED_Dual_AKAK: Manufacturer: Xinglight; Part Number: XL-3210SURUBC; Value: LED; Footprint: praline:LED_Dual_Xinglight_XL-3210_Horizontal
P20 P28 = Conn_02x11_Odd_Even: Manufacturer: Sullins; Part Number: PPPC112LFBN-RC; Value: HEADER_2x11; Footprint: praline:PinSocket_2x11_P2.54mm_Vertical_Flipped
P22 = Conn_02x13_Odd_Even: Manufacturer: Sullins; Part Number: PPPC132LFBN-RC; Value: HEADER_2x13; Footprint: praline:PinSocket_2x13_P2.54mm_Vertical_Flipped
P26 = Conn_02x05_Odd_Even: Manufacturer: Sullins; Part Number: GRPB052VWVN-RC; Value: LPC_JTAG; Footprint: Connector_PinHeader_1.27mm:PinHeader_2x05_P1.27mm_Vertical
R6 R127 R140 R141 = R: Manufacturer: Yageo; Part Number: RC0201JR-07100RL; Substitution: any equivalent; Value: 100; Footprint: Resistor_SMD:R_0201_0603Metric
R7 R37 R48-R50 R59 R62-R64 R66-R68 R75 R93 = R: Manufacturer: Yageo; Part Number: RC0402JR-0710KL; Substitution: any equivalent; Value: 10k; Footprint: Resistor_SMD:R_0402_1005Metric
R18 = R: Manufacturer: Yageo; Part Number: RC0201FR-0722K6L; Substitution: any equivalent; Value: 22.6k; Footprint: Resistor_SMD:R_0201_0603Metric
R19 R30 = R: Manufacturer: Yageo; Part Number: RC0201JR-0733RL; Substitution: any equivalent; Value: 33; Footprint: Resistor_SMD:R_0201_0603Metric
R38 = R: Manufacturer: Yageo; Part Number: RC0402FR-07180KL; Substitution: any equivalent; Value: 180k; Footprint: Resistor_SMD:R_0402_1005Metric
R39 = R: Manufacturer: Yageo; Part Number: RC0402FR-0737K4L; Substitution: any equivalent; Value: 37.4k; Footprint: Resistor_SMD:R_0402_1005Metric
R65 R82 = R: Manufacturer: Yageo; Part Number: RC0402JR-0718KL; Substitution: any equivalent; Value: 18k; Footprint: Resistor_SMD:R_0402_1005Metric
R69 R125 = R: Manufacturer: Yageo; Part Number: RC0201FR-0712KL; Substitution: any equivalent; Value: 12k; Footprint: Resistor_SMD:R_0201_0603Metric
R72 = R: Manufacturer: Yageo; Part Number: RC0201JR-07470RL; Substitution: any equivalent; Value: 470; Footprint: Resistor_SMD:R_0201_0603Metric
R73 = R: Manufacturer: Yageo; Part Number: RC0402JR-073KL; Substitution: any equivalent; Value: 3k; Footprint: Resistor_SMD:R_0402_1005Metric
R74 R76 R107 = R: Manufacturer: Yageo; Part Number: RC0201FR-074K7L; Substitution: any equivalent; Value: 4.7k; Footprint: Resistor_SMD:R_0201_0603Metric
SW1 SW2 = SW_Push_Shielded: Manufacturer: TE Connectivity; Part Number: FSMRA3JH; Value: SWITCH; Footprint: praline:SW_Tactile_SPST_Angled_PTS645Vx58-2LFS
U20 = W25Q32JVSS: Manufacturer: Winbond; Value: W25Q32; Footprint: Package_SO:SOIC-8_5.3x5.3mm_P1.27mm
U23 = LPC43xxFET180: Part Number: LPC4330FET180; Value: LPC4330FET180; Footprint: praline:TFBGA-180_12x12mm_Layout14x14_P0.8mm
X2 = GSG-XTAL4PIN: Manufacturer: Shenzhen SCTF Electronics; Value: MCU_XTAL; Footprint: praline:Crystal_SMD_3225-4Pin_3.2x2.5mm
X3 = Crystal: Manufacturer: YXC; Part Number: XKXGI-SUA-32.768K; Value: RTC_XTAL; Footprint: praline:Crystal_SMD_3215-2Pin_3.2x1.5mm
JP1 = SolderJumper_2_Bridged: Value: SolderJumper_2_Bridged; Footprint: Jumper:SolderJumper-2_P1.3mm_Bridged_RoundedPad1.0x1.5mm
TP5 TP7-TP14 TP24-TP28 TP30 TP31 TP64 = TestPoint: Value: TestPoint; Footprint: TestPoint:TestPoint_Pad_D1.0mm

## Sheet baseband.SchDoc
size 297 x 209 mm
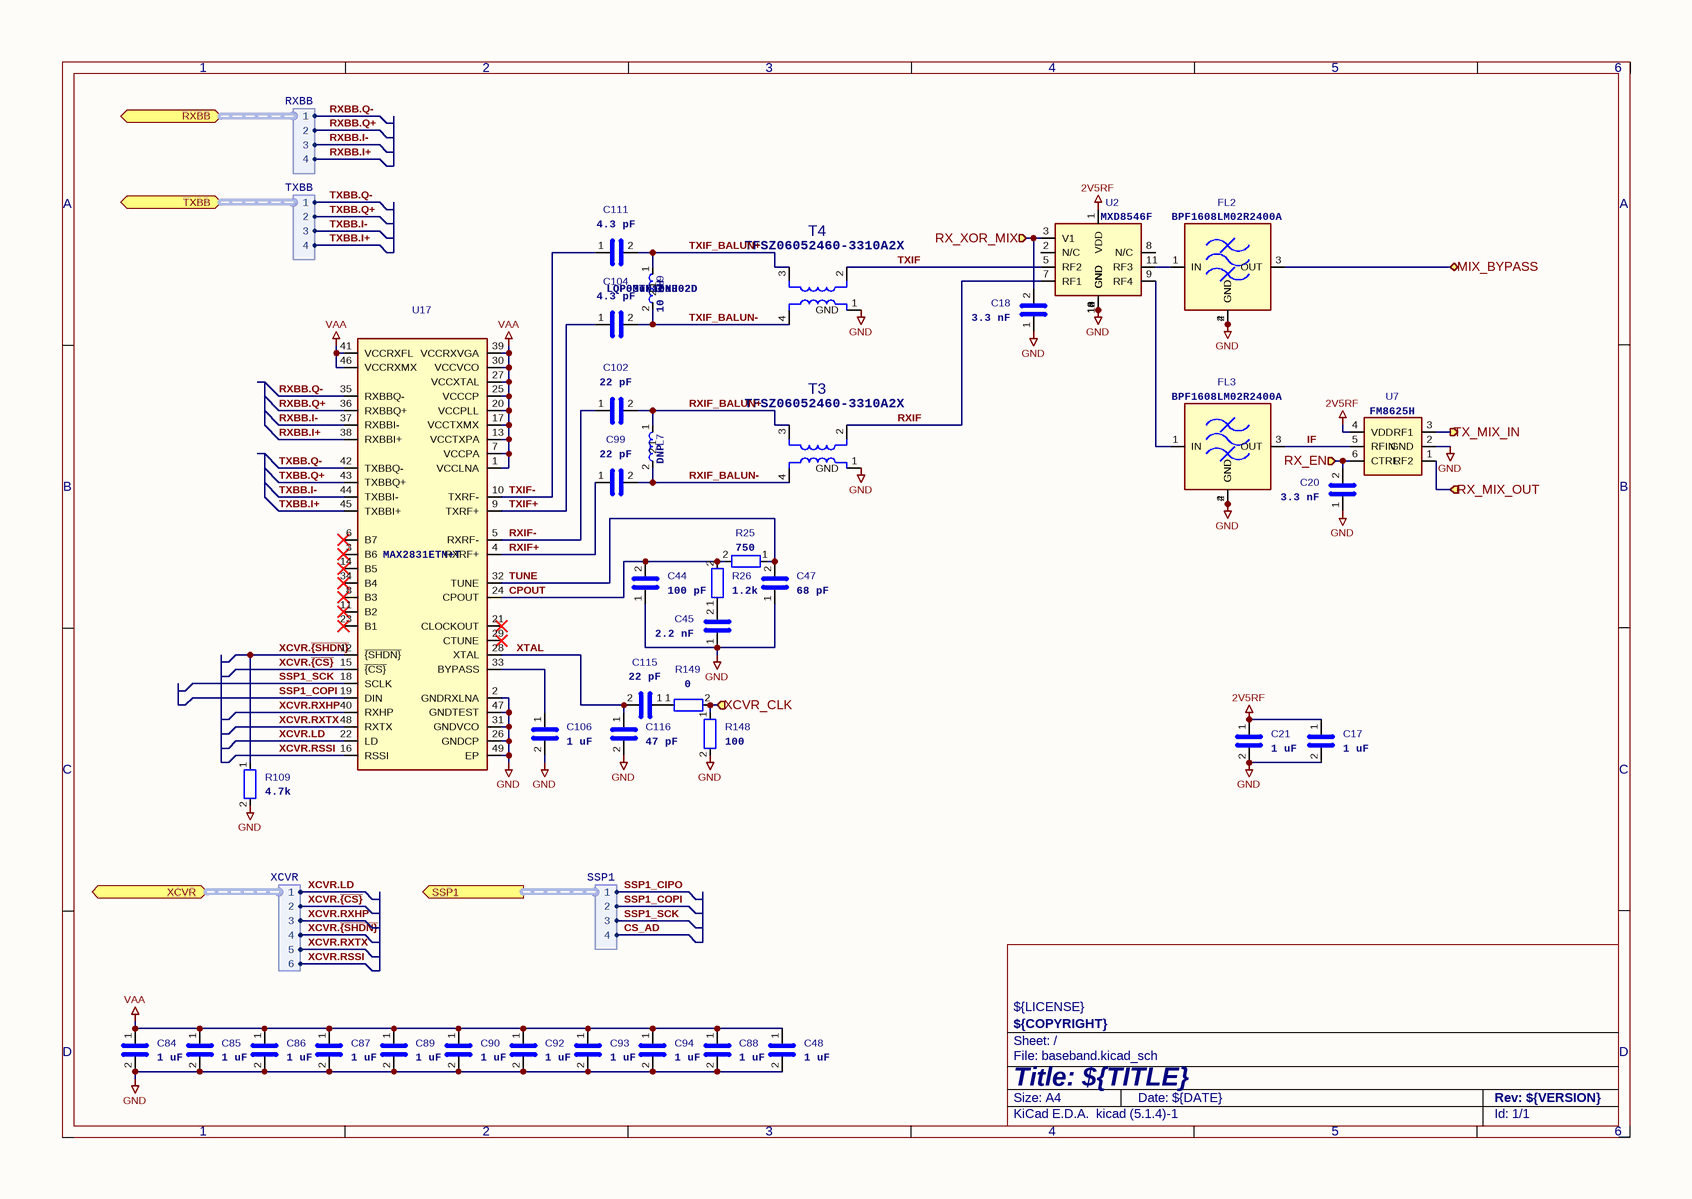
[diagram p3: baseband.SchDoc]

### Parts
C17  1 uF  [C_0201_0603Metric]
C18  3.3 nF  [C_0201_0603Metric]
C20  3.3 nF  [C_0201_0603Metric]
C21  1 uF  [C_0201_0603Metric]
C44  100 pF  [C_0201_0603Metric]
C45  2.2 nF  [C_0201_0603Metric]
C47  68 pF  [C_0201_0603Metric]
C48  1 uF  [C_0201_0603Metric]
C84  1 uF  [C_0201_0603Metric]
C85  1 uF  [C_0201_0603Metric]
C86  1 uF  [C_0201_0603Metric]
C87  1 uF  [C_0201_0603Metric]
C88  1 uF  [C_0201_0603Metric]
C89  1 uF  [C_0201_0603Metric]
C90  1 uF  [C_0201_0603Metric]
C92  1 uF  [C_0201_0603Metric]
C93  1 uF  [C_0201_0603Metric]
C94  1 uF  [C_0201_0603Metric]
C99  22 pF  [C_0201_0603Metric]
C102  22 pF  [C_0201_0603Metric]
C104  4.3 pF  [C_0201_0603Metric]
C106  1 uF  [C_0201_0603Metric]
C111  4.3 pF  [C_0201_0603Metric]
C115  22 pF  [C_0201_0603Metric]
C116  47 pF  [C_0201_0603Metric]
FL2  Part Number: BPF1608LM02R2400A  [Filter_Pulse_BPF1608LM09R5000A]  (hidden comment: BPF)
FL3  Part Number: BPF1608LM02R2400A  [Filter_Pulse_BPF1608LM09R5000A]  (hidden comment: BPF)
L7  DNP  [L_0201_0603Metric]
L9  Manufacturer: Murata  Part Number: LQP03TN10NJ02D  Substitution: LQP03TN10NH02D  [L_0201_0603Metric]  (hidden comment: 10 nH)
R25  750  [R_0201_0603Metric]
R26  1.2k  [R_0201_0603Metric]
R109  4.7k  [R_0201_0603Metric]
R148  100  [R_0201_0603Metric]
R149  0  [R_0201_0603Metric]
T3  IF_BALUN  [Balun_TDK_TFSZ06052460-3310A2X]  (value not drawn)
T4  IF_BALUN  [Balun_TDK_TFSZ06052460-3310A2X]  (value not drawn)
U2  MXD8546F  [QFN-12-1EP_2x2mm_P0.5mm_EP1x1mm]
U7  FM8625H  [TSLP-6-4_1.1x0.7mm_P0.4mm]
U17  Part Number: MAX2831ETM+T  [QFN-48-1EP_7x7mm_P0.5mm_EP5.6x5.6mm_ThermalVias]  (hidden comment: MAX2831)

### Ports
MIX_BYPASS (bidir), RX_EN (in), RX_MIX_OUT (in), RX_XOR_MIX (in), RXBB (bidir, harness RXBB), SSP1 (out, harness SSP1), TX_MIX_IN (out), TXBB (bidir, harness TXBB), XCVR (bidir, harness XCVR), XCVR_CLK (in)

### Harnesses
XCVR: 1, 5, 4, 3, 2, 6
TXBB: 1, 4, 3, 2
RXBB: 1, 4, 3, 2
SSP1: 1, 2, 3, 4

### Nets
2V5RF: C17.1 C21.1 U2.1(VDD) U7.4(VDD)
GND: C17.2 C18.1 C20.1 C21.2 C44.1 C45.1 C47.1 C48.2 C84.2 C85.2 C86.2 C87.2 C88.2 C89.2 C90.2 C92.2 C93.2 C94.2 C106.2 C116.2 FL2.2(GND) FL2.4(GND) FL3.2(GND) FL3.4(GND) R109.2 R148.2 T3.1(GND) T4.1(GND) U2.4(GND) U2.6(GND) U2.10(GND) U2.12(GND) U2.13(GND) U7.2(GND) U17.2(GNDRXLNA) U17.26(GNDCP) U17.31(GNDVCO) U17.47(GNDTEST) U17.49(EP)
VAA: C48.1 C84.1 C85.1 C86.1 C87.1 C88.1 C89.1 C90.1 C92.1 C93.1 C94.1 U17.1(VCCLNA) U17.7(VCCPA) U17.13(VCCTXPA) U17.17(VCCTXMX) U17.20(VCCPLL) U17.25(VCCCP) U17.27(VCCXTAL) U17.30(VCCVCO) U17.39(VCCRXVGA) U17.41(VCCRXFL) U17.46(VCCRXMX)
CPOUT: C44.2 R25.2 R26.2 U17.24(CPOUT)
IF: FL3.3(OUT) U7.5(RFIN)
MIX_BYPASS: FL2.3(OUT) ; port MIX_BYPASS
RX_EN: C20.2 U7.6(CTRL) ; port RX_EN
RX_MIX_OUT: U7.1(RF2) ; port RX_MIX_OUT
RX_XOR_MIX: C18.2 U2.3(V1) ; port RX_XOR_MIX
RXBB.I+: U17.38(RXBBI+) ; port RXBB.4
RXBB.I-: U17.37(RXBBI-) ; port RXBB.3
RXBB.Q+: U17.36(RXBBQ+) ; port RXBB.2
RXBB.Q-: U17.35(RXBBQ-) ; port RXBB.1
RXIF: T3.2 U2.7(RF1)
RXIF+: C99.1 U17.4(RXRF+)
RXIF-: C102.1 U17.5(RXRF-)
RXIF_BALUN+: C102.2 L7.1 T3.3
RXIF_BALUN-: C99.2 L7.2 T3.4
SSP1_COPI: U17.19(DIN) ; port SSP1.2
SSP1_SCK: U17.18(SCLK) ; port SSP1.3
TUNE: C47.2 R25.1 U17.32(TUNE)
TX_MIX_IN: U7.3(RF1) ; port TX_MIX_IN
TXBB.I+: U17.45(TXBBI+) ; port TXBB.4
TXBB.I-: U17.44(TXBBI-) ; port TXBB.3
TXBB.Q+: U17.43(TXBBQ+) ; port TXBB.2
TXBB.Q-: U17.42(TXBBQ-) ; port TXBB.1
TXIF: T4.2 U2.5(RF2)
TXIF+: C104.1 U17.9(TXRF+)
TXIF-: C111.1 U17.10(TXRF-)
TXIF_BALUN+: C111.2 L9.1 T4.3
TXIF_BALUN-: C104.2 L9.2 T4.4
XCVR.LD: U17.22(LD) ; port XCVR.1
XCVR.RSSI: U17.16(RSSI) ; port XCVR.6
XCVR.RXHP: U17.40(RXHP) ; port XCVR.3
XCVR.RXTX: U17.48(RXTX) ; port XCVR.5
XCVR.~{{CS}}: U17.15(~{{CS}}) ; port XCVR.2
XCVR.~{{SHDN}}: R109.1 U17.12(~{{SHDN}}) ; port XCVR.4
XCVR_CLK: R148.1 R149.2 ; port XCVR_CLK
XTAL: C115.2 C116.1 U17.28(XTAL)
NetC45_2: C45.2 R26.1
NetC106_1: C106.1 U17.33(BYPASS)
NetC115_1: C115.1 R149.1
NetFL2_1: FL2.1(IN) U2.11(RF3)
NetFL3_1: FL3.1(IN) U2.9(RF4)

Not connected (* = marked no-connect by the designer): U2 2(N/C) 8(N/C); U17 3(B6)* 6(B7)* 8(B3)* 11(B2)* 14(B5)* 21(CLOCKOUT)* 23(B1)* 29(CTUNE)* 34(B4)*

### Notes on the sheet
- 1
- 2
- 3
- 4
- 5
- 6
- A
- B
- C
- ${LICENSE}
- D
- Title: ${TITLE}
- File: baseband.kicad_sch
- Sheet: /
- ${COPYRIGHT}
- KiCad E.D.A.  kicad (5.1.4)-1
- Size: A4
- Date: ${DATE}
- Rev: ${VERSION}
- Id: 1/1

### Library data of the parts
C17 C21 C48 C84-C90 C92-C94 C106 = C: Manufacturer: Murata; Part Number: GRM033R61A105ME44D; Substitution: GRM033R61A105ME44*, GRM033R61C105ME15*, Samsung CL03A105MO3NRN*; Value: 1 uF; Footprint: Capacitor_SMD:C_0201_0603Metric
C18 C20 = C: Manufacturer: Murata; Part Number: GRM033R71A332KA01D; Substitution: GRM033R71A332K*; Value: 3.3 nF; Footprint: Capacitor_SMD:C_0201_0603Metric
C44 = C: Manufacturer: Murata; Part Number: GRM0335C1E101JA01D; Substitution: GRM0335C1E101JA01*, GRM0335C1H101JA01*; Value: 100 pF; Footprint: Capacitor_SMD:C_0201_0603Metric
C45 = C: Manufacturer: Murata; Part Number: GRM033R71A222KA01D; Substitution: GRM033R71A222KA01*; Value: 2.2 nF; Footprint: Capacitor_SMD:C_0201_0603Metric
C47 = C: Manufacturer: Murata; Part Number: GRM0335C1H680JA01D; Substitution: GRM0335C1H680JA01*; Value: 68 pF; Footprint: Capacitor_SMD:C_0201_0603Metric
C99 C102 C115 = C: Manufacturer: Murata; Part Number: GRM0335C1H220JA01D; Substitution: GRM0335C1H220*; Value: 22 pF; Footprint: Capacitor_SMD:C_0201_0603Metric
C104 C111 = C: Manufacturer: Murata; Part Number: GRM0335C1E4R3CA01D; Substitution: GRM0335C1E4R3*, GRM0335C1H4R3*; Value: 4.3 pF; Footprint: Capacitor_SMD:C_0201_0603Metric
C116 = C: Manufacturer: Murata; Part Number: GRM0335C1E470JA01D; Substitution: GRM0335C1E470JA01*, GRM0335C1H470JA01*; Value: 47 pF; Footprint: Capacitor_SMD:C_0201_0603Metric
FL2 FL3 = BFCN-1445: Manufacturer: Pulse Electronics; Value: BPF; Footprint: praline:Filter_Pulse_BPF1608LM09R5000A
L7 L9 = L: Footprint: Inductor_SMD:L_0201_0603Metric
  L7: Value: DNP
  L9: Value: 10 nH
R25 = R: Manufacturer: Yageo; Part Number: RC0201JR-07750RL; Substitution: any equivalent; Value: 750; Footprint: Resistor_SMD:R_0201_0603Metric
R26 = R: Manufacturer: Yageo; Part Number: RC0201JR-071K2L; Substitution: any equivalent; Value: 1.2k; Footprint: Resistor_SMD:R_0201_0603Metric
R109 = R: as R74 on sheet mcu; Value: 4.7k; Footprint: Resistor_SMD:R_0201_0603Metric
R148 = R: as R6 on sheet mcu; Value: 100; Footprint: Resistor_SMD:R_0201_0603Metric
R149 = R: Manufacturer: Yageo; Part Number: RC0201JR-070RL; Substitution: any equivalent; Value: 0; Footprint: Resistor_SMD:R_0201_0603Metric
T3 T4 = TFSZ06052460-3310A2X: Manufacturer: TDK; Part Number: TFSZ06052460-3310A2X; Value: IF_BALUN; Footprint: praline:Balun_TDK_TFSZ06052460-3310A2X
U2 = MXD8546F: Manufacturer: Maxscend; Part Number: MXD8546F; Value: MXD8546F; Footprint: praline:QFN-12-1EP_2x2mm_P0.5mm_EP1x1mm
U7 = BGS12P2L6: Manufacturer: Shenzhen Fuman; Part Number: FM8625H; Value: FM8625H; Footprint: praline:TSLP-6-4_1.1x0.7mm_P0.4mm
U17 = MAX2831: Manufacturer: Maxim; Substitution: MAX2831ETM+; Value: MAX2831; Footprint: praline:QFN-48-1EP_7x7mm_P0.5mm_EP5.6x5.6mm_ThermalVias

## Sheet frontend.SchDoc
size 297 x 209 mm
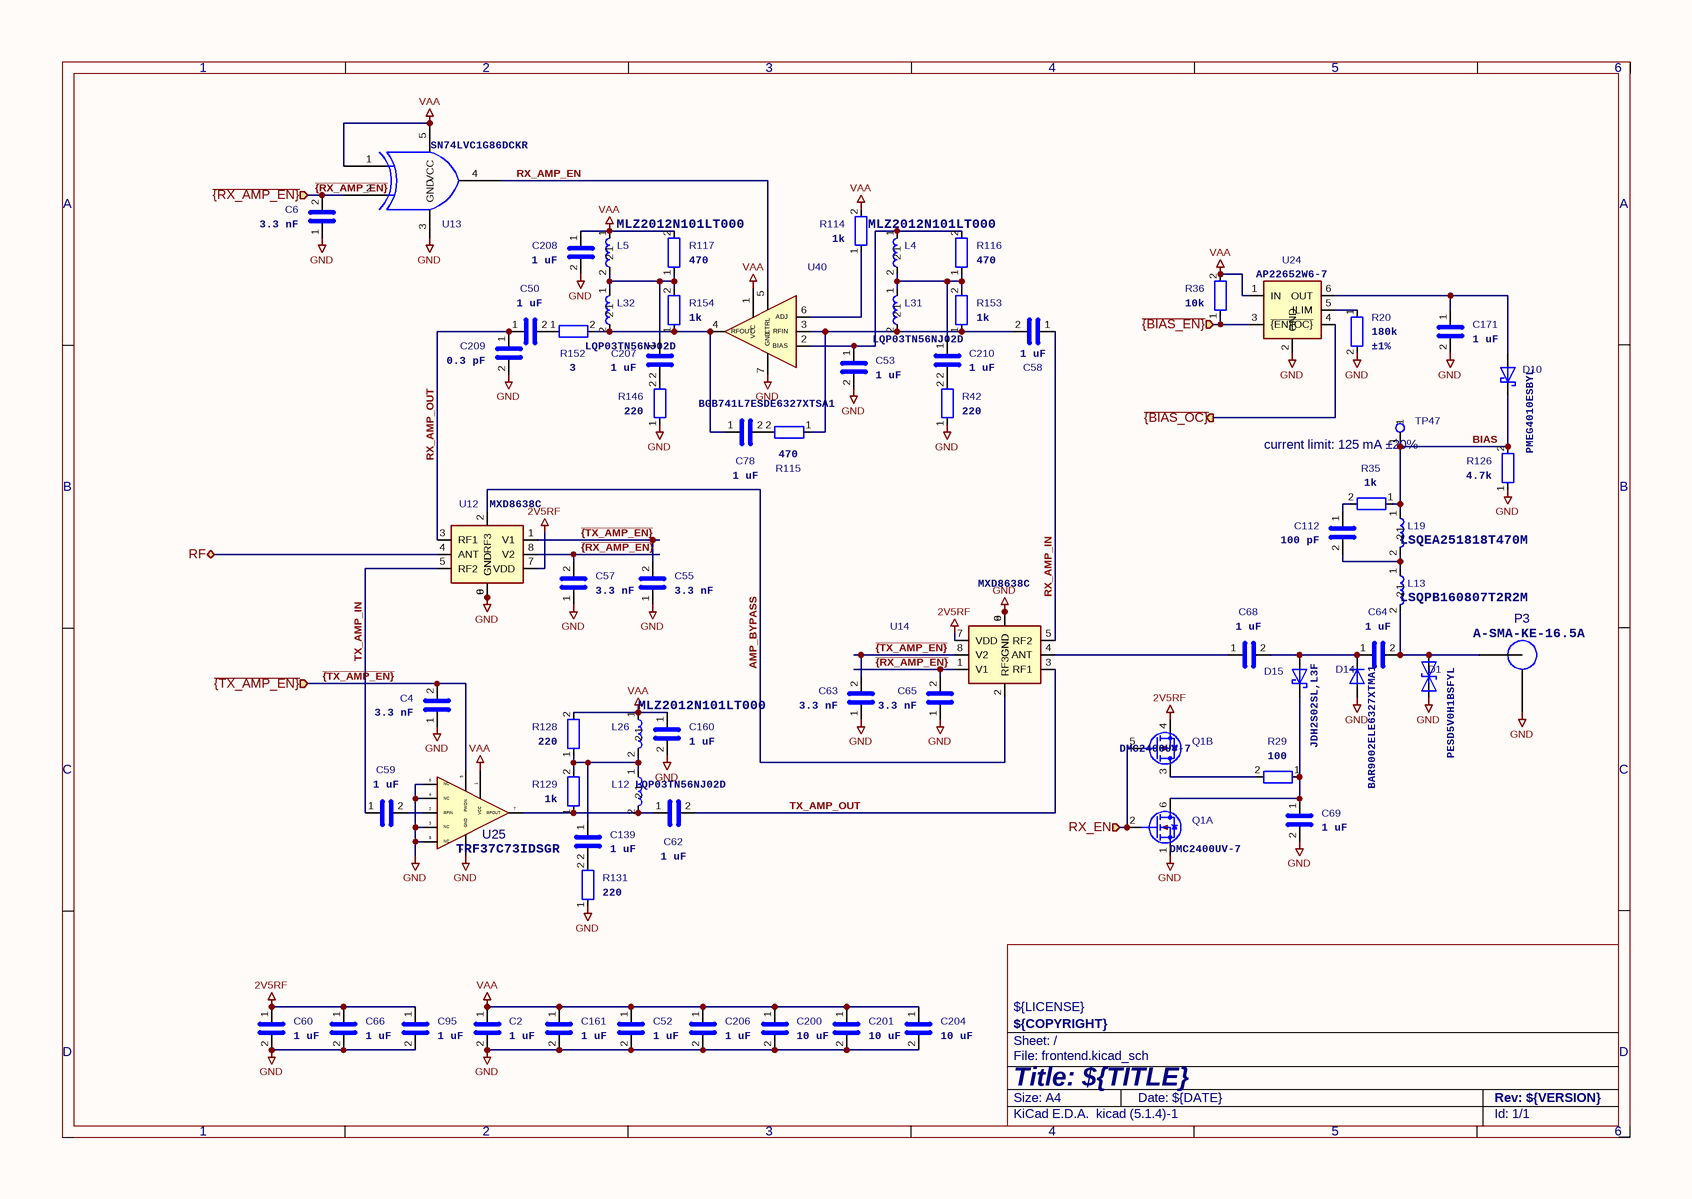
[diagram p4: frontend.SchDoc]

### Parts
C2  1 uF  [C_0201_0603Metric]
C4  3.3 nF  [C_0201_0603Metric]
C6  3.3 nF  [C_0201_0603Metric]
C50  1 uF  [C_0201_0603Metric]
C52  1 uF  [C_0201_0603Metric]
C53  1 uF  [C_0201_0603Metric]
C55  3.3 nF  [C_0201_0603Metric]
C57  3.3 nF  [C_0201_0603Metric]
C58  1 uF  [C_0201_0603Metric]
C59  1 uF  [C_0201_0603Metric]
C60  1 uF  [C_0201_0603Metric]
C62  1 uF  [C_0201_0603Metric]
C63  3.3 nF  [C_0201_0603Metric]
C64  1 uF  [C_0402_1005Metric]
C65  3.3 nF  [C_0201_0603Metric]
C66  1 uF  [C_0201_0603Metric]
C68  1 uF  [C_0201_0603Metric]
C69  1 uF  [C_0201_0603Metric]
C78  1 uF  [C_0201_0603Metric]
C95  1 uF  [C_0201_0603Metric]
C112  100 pF  [C_0201_0603Metric]
C139  1 uF  [C_0201_0603Metric]
C160  1 uF  [C_0201_0603Metric]
C161  1 uF  [C_0201_0603Metric]
C171  1 uF  [C_0402_1005Metric]
C200  10 uF  [C_0805_2012Metric]
C201  10 uF  [C_0805_2012Metric]
C204  10 uF  [C_0805_2012Metric]
C206  1 uF  [C_0201_0603Metric]
C207  1 uF  [C_0201_0603Metric]
C208  1 uF  [C_0201_0603Metric]
C209  0.3 pF  [C_0201_0603Metric]
C210  1 uF  [C_0201_0603Metric]
D1  Part Number: PESD5V0H1BSFYL  [TSSLP-2-1]  (hidden comment: TVS)
D10  Part Number: PMEG4010ESBYL  [TSLP-2-19]  (hidden comment: Schottky)
D14  Part Number: BAR9002ELE6327XTMA1  [TSLP-2-19]  (hidden comment: PIN)
D15  Part Number: JDH2S02SL,L3F  [TSSLP-2-1]  (hidden comment: Schottky)
L4  Part Number: MLZ2012N101LT000  [L_TDK_MLZ2012_h1.25mm]  (hidden comment: 100 uH)
L5  Part Number: MLZ2012N101LT000  [L_TDK_MLZ2012_h1.25mm]  (hidden comment: 100 uH)
L12  Part Number: LQP03TN56NJ02D  [L_0201_0603Metric]  (hidden comment: 56 nH)
L13  Part Number: LSQPB160807T2R2M  [L_0603_1608Metric]  (hidden comment: 2.2 uH)
L19  Part Number: LSQEA251818T470M  [L_Taiyo-Yuden_A251818]  (hidden comment: 47 uH)
L26  Part Number: MLZ2012N101LT000  [L_TDK_MLZ2012_h1.25mm]  (hidden comment: 100 uH)
L31  Part Number: LQP03TN56NJ02D  [L_0201_0603Metric]  (hidden comment: 56 nH)
L32  Part Number: LQP03TN56NJ02D  [L_0201_0603Metric]  (hidden comment: 56 nH)
P3  Part Number: A-SMA-KE-16.5A  [SMA_MyAntenna_A-SMA-KE-16.5A_EdgeMount]  (hidden comment: SMA)
Q1  Part Number: DMC2400UV-7  [SOT-563]  (hidden comment: NMOS/PMOS)  (parts A,B of 2)
R20  Tolerance: ±1%  [R_0402_1005Metric]  (hidden comment: 180k)
R29  100  [R_0201_0603Metric]
R35  1k  [R_0201_0603Metric]
R36  10k  [R_0402_1005Metric]
R42  220  [R_0201_0603Metric]
R114  1k  [R_0201_0603Metric]
R115  470  [R_0201_0603Metric]
R116  470  [R_0201_0603Metric]
R117  470  [R_0201_0603Metric]
R126  4.7k  [R_0201_0603Metric]
R128  220  [R_0201_0603Metric]
R129  1k  [R_0201_0603Metric]
R131  220  [R_0201_0603Metric]
R146  220  [R_0201_0603Metric]
R152  3  [R_0201_0603Metric]
R153  1k  [R_0201_0603Metric]
R154  1k  [R_0201_0603Metric]
TP47  TestPoint  [TestPoint_Pad_D1.0mm]  (value not drawn)
U12  MXD8638C  [MXD8638C]
U13  Part Number: SN74LVC1G86DCKR  [SOT-353_SC-70-5]  (hidden comment: 74LVC1G86)
U14  MXD8638C  [MXD8638C]
U24  Part Number: AP22652W6-7  [TSOP-6_1.65x3.05mm_P0.95mm]  (hidden comment: AP22652)
U25  Part Number: TRF37C73IDSGR  [WSON-8-1EP_2x2mm_P0.5mm_EP0.9x1.6mm]  (hidden comment: TRF37C73)
U40  Part Number: BGB741L7ESDE6327XTSA1  [TSLP-7-1]  (hidden comment: BGB741L7ESD)

### Ports
RF (bidir), RX_EN (in), ~{{BIAS_EN}} (in), ~{{BIAS_OC}} (out), ~{{RX_AMP_EN}} (in), ~{{TX_AMP_EN}} (in)

### Nets
2V5RF: C60.1 C66.1 C95.1 Q1.4(S) U12.7(VDD) U14.7(VDD)
GND: C2.2 C4.1 C6.1 C52.2 C53.2 C55.1 C57.1 C60.2 C63.1 C65.1 C66.2 C69.2 C95.2 C160.2 C161.2 C171.2 C200.2 C201.2 C204.2 C206.2 C208.2 C209.2 D1.2(A2) D14.2(A) P3.2(GND) Q1.1(S) R20.2 R42.1 R126.1 R131.1 R146.1 U12.6(GND) U12.9(GND) U13.3(GND) U14.6(GND) U14.9(GND) U24.2(GND) U25.3(NC) U25.4(NC) U25.6(NC) U25.8(NC) U25.9(GND) U40.7(GND)
VAA: C2.1 C52.1 C160.1 C161.1 C200.1 C201.1 C204.1 C206.1 C208.1 L5.1 L26.1 R36.2 R114.2 R117.2 R128.2 U13.1 U13.5(VCC) U24.1(IN) U25.1(VCC) U40.1(VCC)
AMP_BYPASS: U12.2(RF3) U14.2(RF3)
BIAS: D10.1(K) L19.1 R35.1 R126.2 TP47.1
RF: U12.4(ANT) ; port RF
RX_AMP_EN: U13.4 U40.5(CTRL)
RX_AMP_IN: C58.1 U14.5(RF2)
RX_AMP_OUT: C50.1 C209.1 U12.3(RF1)
RX_EN: Q1.2(G) Q1.5(G) ; port RX_EN
TX_AMP_IN: C59.1 U12.5(RF2)
TX_AMP_OUT: C62.2 U14.3(RF1)
~{{BIAS_EN}}: R36.1 U24.3(~{{EN}}) ; port ~{{BIAS_EN}}
~{{BIAS_OC}}: U24.4(~{{OC}}) ; port ~{{BIAS_OC}}
~{{RX_AMP_EN}}: C6.2 C57.2 C65.2 U12.8(V2) U13.2 U14.1(V1) ; port ~{{RX_AMP_EN}}
~{{TX_AMP_EN}}: C4.2 C55.2 C63.2 U12.1(V1) U14.8(V2) U25.5(PWDN) ; port ~{{TX_AMP_EN}}
NetC50_2: C50.2 R152.1
NetC53_1: C53.1 L4.1 R116.2 U40.2(BIAS)
NetC58_2: C58.2 L31.2 R115.1 R153.1 U40.3(RFIN)
NetC59_2: C59.2 U25.2(RFIN)
NetC62_1: C62.1 L12.2 R129.1 U25.7(RFOUT)
NetC64_1: C64.1 C68.2 D14.1(K) D15.2(A)
NetC64_2: C64.2 D1.1(A1) L13.2 P3.1(RF)
NetC68_1: C68.1 U14.4(ANT)
NetC69_1: C69.1 D15.1(K) Q1.6(D) R29.1
NetC78_1: C78.1 L32.2 R152.2 R154.1 U40.4(RFOUT)
NetC78_2: C78.2 R115.2
NetC112_1: C112.1 R35.2
NetC112_2: C112.2 L13.1 L19.2
NetC139_1: C139.1 L12.1 L26.2 R128.1 R129.2
NetC139_2: C139.2 R131.2
NetC171_1: C171.1 D10.2(A) U24.6(OUT)
NetC207_1: C207.1 L5.2 L32.1 R117.1 R154.2
NetC207_2: C207.2 R146.2
NetC210_1: C210.1 L4.2 L31.1 R116.1 R153.2
NetC210_2: C210.2 R42.2
NetQ1_3: Q1.3(D) R29.2
NetR20_1: R20.1 U24.5(ILIM)
NetR114_1: R114.1 U40.6(ADJ)

### Notes on the sheet
- (near TP47) current limit: 125 mA ±20%
- 1
- 2
- 3
- 4
- 5
- 6
- A
- B
- C
- ${LICENSE}
- D
- Title: ${TITLE}
- File: frontend.kicad_sch
- Sheet: /
- ${COPYRIGHT}
- KiCad E.D.A.  kicad (5.1.4)-1
- Size: A4
- Date: ${DATE}
- Rev: ${VERSION}
- Id: 1/1

### Library data of the parts
C2 C50 C52 C53 C58-C60 C62 C66 C68 C69 C78 C95 C139 C160 C161 C206-C208 C210 = C: as C17 on sheet baseband; Value: 1 uF; Footprint: Capacitor_SMD:C_0201_0603Metric
C4 C6 C55 C57 C63 C65 = C: as C18 on sheet baseband; Value: 3.3 nF; Footprint: Capacitor_SMD:C_0201_0603Metric
C64 C171 = C: as C80 on sheet mcu; Value: 1 uF; Footprint: Capacitor_SMD:C_0402_1005Metric
C112 = C: as C44 on sheet baseband; Value: 100 pF; Footprint: Capacitor_SMD:C_0201_0603Metric
C200 C201 C204 = C: Manufacturer: Samsung; Part Number: CL21A106KOQNNNE; Substitution: Murata GRM21BR61A106KE19L; Value: 10 uF; Footprint: Capacitor_SMD:C_0805_2012Metric
C209 = C: Manufacturer: Murata; Part Number: GRM0335C1ER30BA01D; Substitution: GRM0335C1*R30*A01*, GRM0335C2*R30*A01*; Value: 0.3 pF; Footprint: Capacitor_SMD:C_0201_0603Metric
D1 = D_TVS: Manufacturer: Nexperia; Substitution: PESD5V0H1BSF; Value: TVS; Footprint: praline:TSSLP-2-1
D10 = D_Schottky: Manufacturer: Nexperia; Value: Schottky; Footprint: praline:TSLP-2-19
D14 = D: Manufacturer: Infineon; Value: PIN; Footprint: praline:TSLP-2-19
D15 = D_Schottky: Manufacturer: Toshiba; Value: Schottky; Footprint: praline:TSSLP-2-1
L4 L5 L26 = L: Manufacturer: TDK; Substitution: MLZ2012N101LTD25; Value: 100 uH; Footprint: praline:L_TDK_MLZ2012_h1.25mm
L12 L31 L32 = L: Manufacturer: Murata; Substitution: LQP03TN56NH02D; Value: 56 nH; Footprint: Inductor_SMD:L_0201_0603Metric
L13 = L: Manufacturer: Taiyo Yuden; Substitution: BRL1608T2R2M, LLQPB160807T2R2M; Value: 2.2 uH; Footprint: Inductor_SMD:L_0603_1608Metric
L19 = L: Manufacturer: Taiyo Yuden; Substitution: LSQEA251818T470K, LBR2518T470M, LBR2518T470K; Value: 47 uH; Footprint: praline:L_Taiyo-Yuden_A251818
P3 = GSG-RF-CONN: Manufacturer: MyAntenna; Substitution: M04-0102170R0A; Value: SMA; Footprint: praline:SMA_MyAntenna_A-SMA-KE-16.5A_EdgeMount
Q1 = Q_Dual_NMOS_PMOS_S1G1D2S2G2D1: Manufacturer: Diodes Inc.; Substitution: DMC2400UV*; Value: NMOS/PMOS; Footprint: Package_TO_SOT_SMD:SOT-563
R20 = R: as R38 on sheet mcu; Value: 180k; Footprint: Resistor_SMD:R_0402_1005Metric
R29 = R: as R6 on sheet mcu; Value: 100; Footprint: Resistor_SMD:R_0201_0603Metric
R35 R114 R129 R153 R154 = R: Manufacturer: Yageo; Part Number: RC0201FR-071KL; Substitution: any equivalent; Value: 1k; Footprint: Resistor_SMD:R_0201_0603Metric
R36 = R: as R7 on sheet mcu; Value: 10k; Footprint: Resistor_SMD:R_0402_1005Metric
R42 R128 R131 R146 = R: Manufacturer: Yageo; Part Number: RC0201JR-07220RL; Substitution: any equivalent; Value: 220; Footprint: Resistor_SMD:R_0201_0603Metric
R115-R117 = R: as R72 on sheet mcu; Value: 470; Footprint: Resistor_SMD:R_0201_0603Metric
R126 = R: as R74 on sheet mcu; Value: 4.7k; Footprint: Resistor_SMD:R_0201_0603Metric
R152 = R: Manufacturer: Yageo; Part Number: RC0201JR-073RL; Substitution: any equivalent; Value: 3; Footprint: Resistor_SMD:R_0201_0603Metric
U12 U14 = MXD8638: Manufacturer: Maxscend; Part Number: MXD8638C; Value: MXD8638C; Footprint: praline:MXD8638C
U13 = 74LVC1G86: Manufacturer: UMW; Substitution: TI SN74LVC1G86DCKR; Value: 74LVC1G86; Footprint: Package_TO_SOT_SMD:SOT-353_SC-70-5
U24 = BD2243G: Manufacturer: Diodes Inc.; Value: AP22652; Footprint: Package_SO:TSOP-6_1.65x3.05mm_P0.95mm
U25 = TRF37A73: Manufacturer: Texas Instruments; Substitution: TRF37C73*; Value: TRF37C73; Footprint: Package_SON:WSON-8-1EP_2x2mm_P0.5mm_EP0.9x1.6mm
U40 = BGB741L7ESD: Manufacturer: Infineon; Value: BGB741L7ESD; Footprint: praline:TSLP-7-1
TP47 = TestPoint: Value: TestPoint; Footprint: TestPoint:TestPoint_Pad_D1.0mm